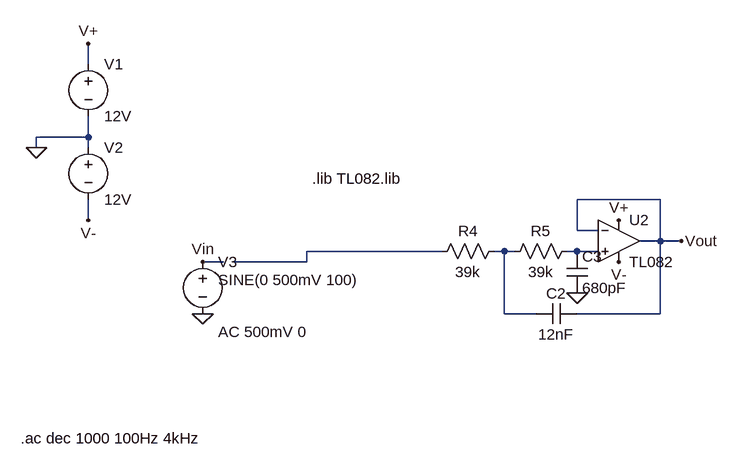
[diagram p0: schematic Stage2.asc]
Stage2.asc, the LTspice schematic file:
Version 4
SHEET 1 880 680
WIRE -240 -128 -240 -160
WIRE -240 -16 -240 -48
WIRE -240 -16 -320 -16
WIRE -320 0 -320 -16
WIRE -240 0 -240 -16
WIRE 640 80 512 80
WIRE -240 112 -240 80
WIRE 512 128 512 80
WIRE 544 128 512 128
WIRE 640 144 640 80
WIRE 640 144 608 144
WIRE 672 144 640 144
WIRE 304 160 96 160
WIRE 400 160 384 160
WIRE 416 160 400 160
WIRE 512 160 496 160
WIRE 544 160 512 160
WIRE -32 176 -64 176
WIRE 96 176 96 160
WIRE 96 176 -16 176
WIRE 400 256 400 160
WIRE 448 256 400 256
WIRE 640 256 640 144
WIRE 640 256 512 256
FLAG 512 224 0
FLAG -320 0 0
FLAG -240 -160 V+
FLAG 576 112 V+
FLAG -240 112 V-
FLAG 576 176 V-
FLAG -64 256 0
FLAG 672 144 Vout
FLAG -64 176 Vin
SYMBOL Opamps\\opamp2 576 80 R0
SYMATTR InstName U2
SYMATTR Value TL082
SYMBOL res 400 144 R90
WINDOW 0 0 56 VBottom 2
WINDOW 3 32 56 VTop 2
SYMATTR InstName R4
SYMATTR Value 39k
SYMBOL res 512 144 R90
WINDOW 0 0 56 VBottom 2
WINDOW 3 32 56 VTop 2
SYMATTR InstName R5
SYMATTR Value 39k
SYMBOL cap 512 240 R90
WINDOW 0 0 32 VBottom 2
WINDOW 3 32 32 VTop 2
SYMATTR InstName C2
SYMATTR Value 12nF
SYMBOL cap 496 160 R0
SYMATTR InstName C3
SYMATTR Value 680pF
SYMBOL voltage -240 -144 R0
WINDOW 123 0 0 Left 0
WINDOW 39 0 0 Left 0
SYMATTR InstName V1
SYMATTR Value 12V
SYMBOL voltage -240 -16 R0
WINDOW 123 0 0 Left 0
WINDOW 39 0 0 Left 0
SYMATTR InstName V2
SYMATTR Value 12V
SYMBOL voltage -64 160 R0
WINDOW 123 24 124 Left 2
WINDOW 39 0 0 Left 0
WINDOW 3 24 44 Left 2
SYMATTR Value2 AC 500mV 0
SYMATTR InstName V3
SYMATTR Value SINE(0 500mV 100)
TEXT -344 448 Left 2 !.ac dec 1000 100Hz 4kHz
TEXT 104 48 Left 2 !.lib TL082.lib

The netlist it stands for:
* Stage2.asc
XU2 N003 Vout V+ V- Vout TL082  ; pins In+ In- V+ V- OUT
R4 N002 N001 39k
R5 N003 N002 39k
C2 Vout N002 12nF
C3 N003 0 680pF
V1 V+ 0 12V
V2 0 V- 12V
V3 Vin 0 SINE(0 500mV 100) AC 500mV 0
.ac dec 1000 100Hz 4kHz
.lib TL082.lib
.backanno
.end